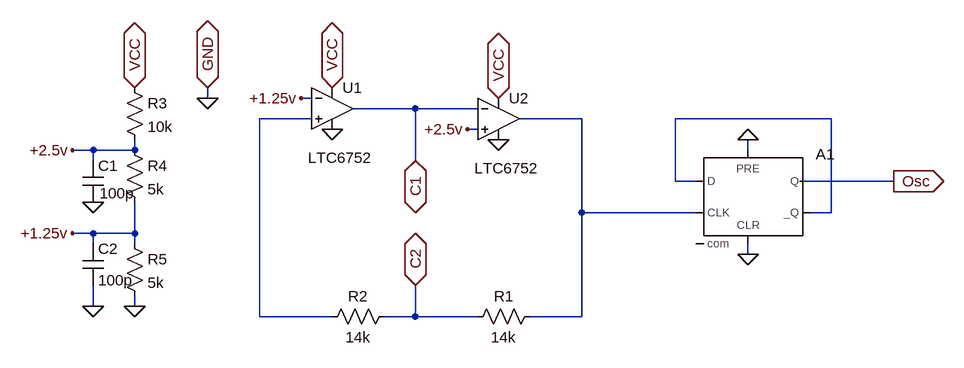
[diagram p0: schematic Oscilator.asc]
Oscilator.asc, the LTspice schematic file:
Version 4
SHEET 1 880 680
WIRE -320 -64 -320 -80
WIRE -160 -64 -176 -64
WIRE 0 -48 -96 -48
WIRE 96 -48 0 -48
WIRE -160 -32 -240 -32
WIRE 256 -32 160 -32
WIRE 640 -32 400 -32
WIRE 96 -16 80 -16
WIRE -496 16 -528 16
WIRE -432 16 -432 0
WIRE -432 16 -496 16
WIRE 512 16 512 0
WIRE -496 32 -496 16
WIRE 0 32 0 -48
WIRE 400 64 400 -32
WIRE 432 64 400 64
WIRE 736 64 592 64
WIRE 256 112 256 -32
WIRE 432 112 256 112
WIRE 640 112 640 -32
WIRE 640 112 608 112
WIRE -496 144 -528 144
WIRE -432 144 -432 96
WIRE -432 144 -496 144
WIRE -496 160 -496 144
WIRE -432 160 -432 144
WIRE 512 176 512 160
WIRE -496 256 -496 224
WIRE -432 256 -432 240
WIRE -240 272 -240 -32
WIRE -128 272 -240 272
WIRE 0 272 0 224
WIRE 0 272 -48 272
WIRE 96 272 0 272
WIRE 256 272 256 112
WIRE 256 272 176 272
FLAG -128 -16 0
FLAG 128 0 0
FLAG -176 -64 +1.25v
FLAG 80 -16 +2.5v
FLAG 512 176 0
FLAG 512 0 0
FLAG 0 32 C1
IOPIN 0 32 BiDir
FLAG 0 224 C2
IOPIN 0 224 BiDir
FLAG 736 64 Osc
IOPIN 736 64 Out
FLAG -432 -80 VCC
IOPIN -432 -80 BiDir
FLAG -496 96 0
FLAG -528 16 +2.5v
FLAG -432 256 0
FLAG -496 256 0
FLAG -528 144 +1.25v
FLAG -128 -80 VCC
IOPIN -128 -80 BiDir
FLAG 128 -64 VCC
IOPIN 128 -64 BiDir
FLAG -320 -80 GND
IOPIN -320 -80 BiDir
FLAG -320 -64 0
SYMBOL Comparators\\LTC6752 -128 -112 R0
WINDOW 3 -37 140 Left 2
SYMATTR InstName U1
SYMBOL res 192 256 R90
WINDOW 0 0 56 VBottom 2
WINDOW 3 32 56 VTop 2
SYMATTR InstName R1
SYMATTR Value 14k
SYMBOL res -32 256 R90
WINDOW 0 0 56 VBottom 2
WINDOW 3 32 56 VTop 2
SYMATTR InstName R2
SYMATTR Value 14k
SYMBOL Comparators\\LTC6752 128 -96 R0
WINDOW 3 -37 140 Left 2
SYMATTR InstName U2
SYMBOL Digital\\dflop 512 16 R0
SYMATTR InstName A1
SYMATTR SpiceLine vhigh=5
SYMBOL res -448 -96 R0
SYMATTR InstName R3
SYMATTR Value 10k
SYMBOL res -448 0 R0
SYMATTR InstName R4
SYMATTR Value 5k
SYMBOL cap -512 32 R0
WINDOW 3 26 50 Left 2
SYMATTR Value 100p
SYMATTR InstName C1
SYMBOL res -448 144 R0
SYMATTR InstName R5
SYMATTR Value 5k
SYMBOL cap -512 160 R0
SYMATTR InstName C2
SYMATTR Value 100p

The netlist it stands for:
* Oscilator.asc
XU1 N001 +1.25v VCC 0 C1 LTC6752  ; pins In+ In- V+ V- OUT
R1 N002 C2 14k
R2 C2 N001 14k
XU2 +2.5v C1 VCC 0 N002 LTC6752  ; pins In+ In- V+ V- OUT
A1 N003 0 N002 0 0 N003 Osc 0 DFLOP vhigh=5
R3 VCC +2.5v 10k
R4 +2.5v +1.25v 5k
C1 +2.5v 0 100p
R5 +1.25v 0 5k
C2 +1.25v 0 100p
.lib LTC7.lib
.backanno
.end